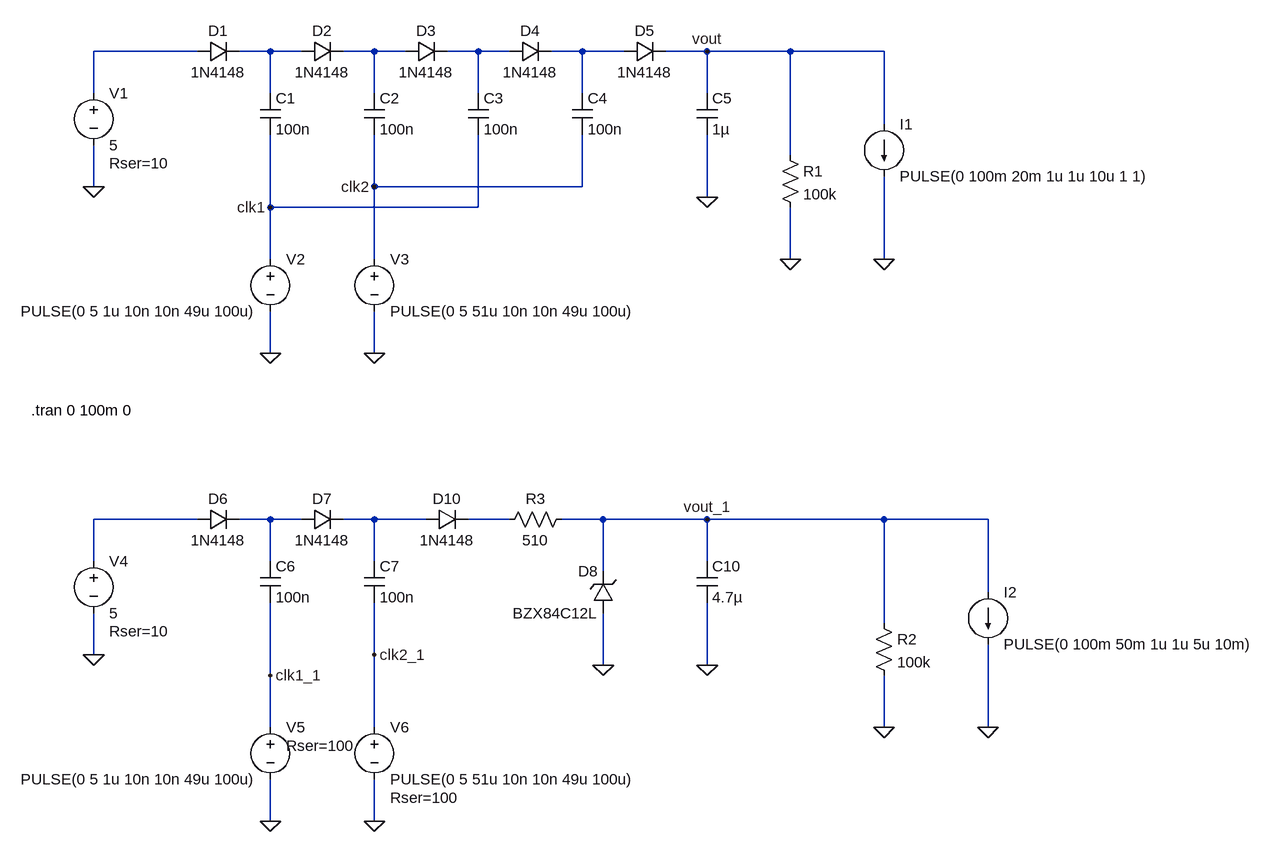
[diagram p0: schematic dickson.asc]
dickson.asc, the LTspice schematic file:
Version 4
SHEET 1 1368 1188
WIRE -352 -16 -512 -16
WIRE -240 -16 -288 -16
WIRE -192 -16 -240 -16
WIRE -80 -16 -128 -16
WIRE -32 -16 -80 -16
WIRE 80 -16 32 -16
WIRE 128 -16 80 -16
WIRE 240 -16 192 -16
WIRE 304 -16 240 -16
WIRE 432 -16 368 -16
WIRE 560 -16 432 -16
WIRE 704 -16 560 -16
WIRE -512 48 -512 -16
WIRE -240 48 -240 -16
WIRE -80 48 -80 -16
WIRE 80 48 80 -16
WIRE 240 48 240 -16
WIRE 432 48 432 -16
WIRE 704 96 704 -16
WIRE 560 144 560 -16
WIRE -512 192 -512 128
WIRE -80 192 -80 112
WIRE 240 192 240 112
WIRE 240 192 -80 192
WIRE 432 208 432 112
WIRE -240 224 -240 112
WIRE 80 224 80 112
WIRE 80 224 -240 224
WIRE -240 304 -240 224
WIRE -80 304 -80 192
WIRE 560 304 560 224
WIRE 704 304 704 176
WIRE -240 448 -240 384
WIRE -80 448 -80 384
WIRE -352 704 -512 704
WIRE -240 704 -288 704
WIRE -192 704 -240 704
WIRE -80 704 -128 704
WIRE 0 704 -80 704
WIRE 128 704 64 704
WIRE 272 704 208 704
WIRE 432 704 272 704
WIRE 704 704 432 704
WIRE 864 704 704 704
WIRE -512 768 -512 704
WIRE -240 768 -240 704
WIRE -80 768 -80 704
WIRE 432 768 432 704
WIRE 272 784 272 704
WIRE 864 816 864 704
WIRE 704 864 704 704
WIRE -512 912 -512 848
WIRE -80 912 -80 832
WIRE 272 928 272 848
WIRE 432 928 432 832
WIRE -240 944 -240 832
WIRE -240 1024 -240 944
WIRE -80 1024 -80 912
WIRE 704 1024 704 944
WIRE 864 1024 864 896
WIRE -240 1168 -240 1104
WIRE -80 1168 -80 1104
FLAG -512 192 0
FLAG -240 448 0
FLAG -80 448 0
FLAG 560 304 0
FLAG 432 208 0
FLAG -240 224 clk1
FLAG -80 192 clk2
FLAG 432 -16 vout
FLAG -512 912 0
FLAG -240 1168 0
FLAG -80 1168 0
FLAG 704 1024 0
FLAG 432 928 0
FLAG -240 944 clk1_1
FLAG -80 912 clk2_1
FLAG 432 704 vout_1
FLAG 704 304 0
FLAG 864 1024 0
FLAG 272 928 0
SYMBOL diode -352 0 R270
WINDOW 0 32 32 VTop 2
WINDOW 3 0 32 VBottom 2
SYMATTR InstName D1
SYMATTR Value 1N4148
SYMBOL cap -256 48 R0
SYMATTR InstName C1
SYMATTR Value 100n
SYMBOL diode -192 0 R270
WINDOW 0 32 32 VTop 2
WINDOW 3 0 32 VBottom 2
SYMATTR InstName D2
SYMATTR Value 1N4148
SYMBOL cap -96 48 R0
SYMATTR InstName C2
SYMATTR Value 100n
SYMBOL diode -32 0 R270
WINDOW 0 32 32 VTop 2
WINDOW 3 0 32 VBottom 2
SYMATTR InstName D3
SYMATTR Value 1N4148
SYMBOL cap 64 48 R0
SYMATTR InstName C3
SYMATTR Value 100n
SYMBOL diode 128 0 R270
WINDOW 0 32 32 VTop 2
WINDOW 3 0 32 VBottom 2
SYMATTR InstName D4
SYMATTR Value 1N4148
SYMBOL cap 224 48 R0
SYMATTR InstName C4
SYMATTR Value 100n
SYMBOL diode 304 0 R270
WINDOW 0 32 32 VTop 2
WINDOW 3 0 32 VBottom 2
SYMATTR InstName D5
SYMATTR Value 1N4148
SYMBOL voltage -512 32 R0
WINDOW 123 0 0 Left 2
WINDOW 39 24 124 Left 2
SYMATTR SpiceLine Rser=10
SYMATTR InstName V1
SYMATTR Value 5
SYMBOL voltage -240 288 R0
WINDOW 3 -384 96 Left 2
WINDOW 123 0 0 Left 2
WINDOW 39 0 0 Left 2
SYMATTR Value PULSE(0 5 1u 10n 10n 49u 100u)
SYMATTR InstName V2
SYMBOL voltage -80 288 R0
WINDOW 123 0 0 Left 2
WINDOW 39 0 0 Left 2
SYMATTR InstName V3
SYMATTR Value PULSE(0 5 51u 10n 10n 49u 100u)
SYMBOL res 544 128 R0
SYMATTR InstName R1
SYMATTR Value 100k
SYMBOL cap 416 48 R0
SYMATTR InstName C5
SYMATTR Value 1µ
SYMBOL diode -352 720 R270
WINDOW 0 32 32 VTop 2
WINDOW 3 0 32 VBottom 2
SYMATTR InstName D6
SYMATTR Value 1N4148
SYMBOL cap -256 768 R0
SYMATTR InstName C6
SYMATTR Value 100n
SYMBOL diode -192 720 R270
WINDOW 0 32 32 VTop 2
WINDOW 3 0 32 VBottom 2
SYMATTR InstName D7
SYMATTR Value 1N4148
SYMBOL cap -96 768 R0
SYMATTR InstName C7
SYMATTR Value 100n
SYMBOL diode 0 720 R270
WINDOW 0 32 32 VTop 2
WINDOW 3 0 32 VBottom 2
SYMATTR InstName D10
SYMATTR Value 1N4148
SYMBOL voltage -512 752 R0
WINDOW 123 0 0 Left 2
WINDOW 39 24 124 Left 2
SYMATTR SpiceLine Rser=10
SYMATTR InstName V4
SYMATTR Value 5
SYMBOL voltage -240 1008 R0
WINDOW 3 -384 96 Left 2
WINDOW 123 0 0 Left 2
WINDOW 39 24 44 Left 2
SYMATTR Value PULSE(0 5 1u 10n 10n 49u 100u)
SYMATTR SpiceLine Rser=100
SYMATTR InstName V5
SYMBOL voltage -80 1008 R0
WINDOW 123 0 0 Left 2
WINDOW 39 24 124 Left 2
SYMATTR SpiceLine Rser=100
SYMATTR InstName V6
SYMATTR Value PULSE(0 5 51u 10n 10n 49u 100u)
SYMBOL res 688 848 R0
SYMATTR InstName R2
SYMATTR Value 100k
SYMBOL cap 416 768 R0
SYMATTR InstName C10
SYMATTR Value 4.7µ
SYMBOL current 704 96 R0
WINDOW 123 0 0 Left 2
WINDOW 39 0 0 Left 2
SYMATTR InstName I1
SYMATTR Value PULSE(0 100m 20m 1u 1u 10u 1 1)
SYMBOL current 864 816 R0
WINDOW 123 0 0 Left 2
WINDOW 39 0 0 Left 2
SYMATTR InstName I2
SYMATTR Value PULSE(0 100m 50m 1u 1u 5u 10m)
SYMBOL res 224 688 R90
WINDOW 0 0 56 VBottom 2
WINDOW 3 32 56 VTop 2
SYMATTR InstName R3
SYMATTR Value 510
SYMBOL zener 288 848 R180
WINDOW 0 24 64 Left 2
WINDOW 3 24 0 Left 2
SYMATTR InstName D8
SYMATTR Value BZX84C12L
SYMATTR Description Diode
SYMATTR Type diode
TEXT -608 536 Left 2 !.tran 0 100m 0

The netlist it stands for:
* dickson.asc
D1 N001 N002 1N4148
C1 N002 clk1 100n
D2 N002 N003 1N4148
C2 N003 clk2 100n
D3 N003 N004 1N4148
C3 N004 clk1 100n
D4 N004 N005 1N4148
C4 N005 clk2 100n
D5 N005 vout 1N4148
V1 N001 0 5 Rser=10
V2 clk1 0 PULSE(0 5 1u 10n 10n 49u 100u)
V3 clk2 0 PULSE(0 5 51u 10n 10n 49u 100u)
R1 vout 0 100k
C5 vout 0 1µ
D6 N006 N007 1N4148
C6 N007 clk1_1 100n
D7 N007 N008 1N4148
C7 N008 clk2_1 100n
D10 N008 N009 1N4148
V4 N006 0 5 Rser=10
V5 clk1_1 0 PULSE(0 5 1u 10n 10n 49u 100u) Rser=100
V6 clk2_1 0 PULSE(0 5 51u 10n 10n 49u 100u) Rser=100
R2 vout_1 0 100k
C10 vout_1 0 4.7µ
I1 vout 0 PULSE(0 100m 20m 1u 1u 10u 1 1)
I2 vout_1 0 PULSE(0 100m 50m 1u 1u 5u 10m)
R3 vout_1 N009 510
D8 0 vout_1 BZX84C12L
.model D D
.lib standard.dio
.tran 0 100m 0
.backanno
.end